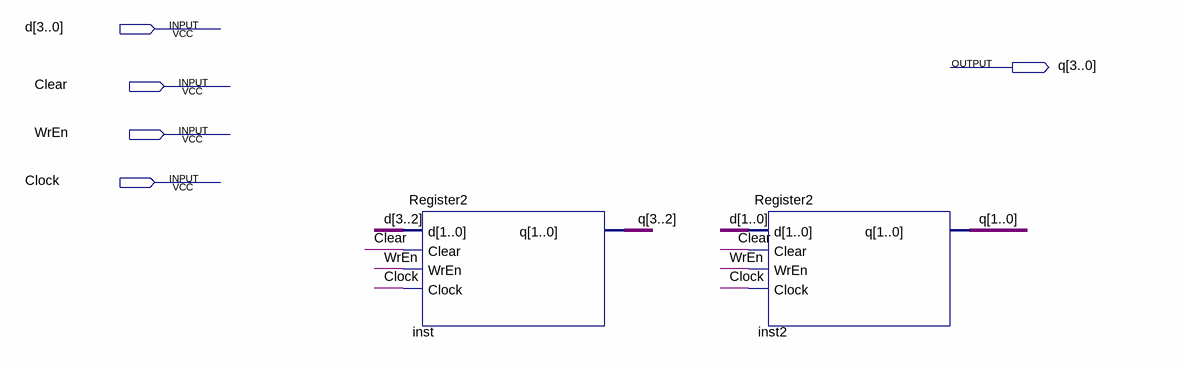
[diagram p0: schematic sheet]
// Quartus schematic Register4.bdf as structural Verilog: 2 symbols, 5 pins
module Register4 (
  input  [3:0] d,
  input  Clear,
  input  WrEn,
  input  Clock,
  output [3:0] q
);

  Register2 inst (.d(d[3:2]), .Clear(Clear), .WrEn(WrEn), .Clock(Clock), .q(q[3:2]));
  Register2 inst2 (.d(d[1:0]), .Clear(Clear), .WrEn(WrEn), .Clock(Clock), .q(q[1:0]));
endmodule
